# Altium project Production_v4.PrjPcb
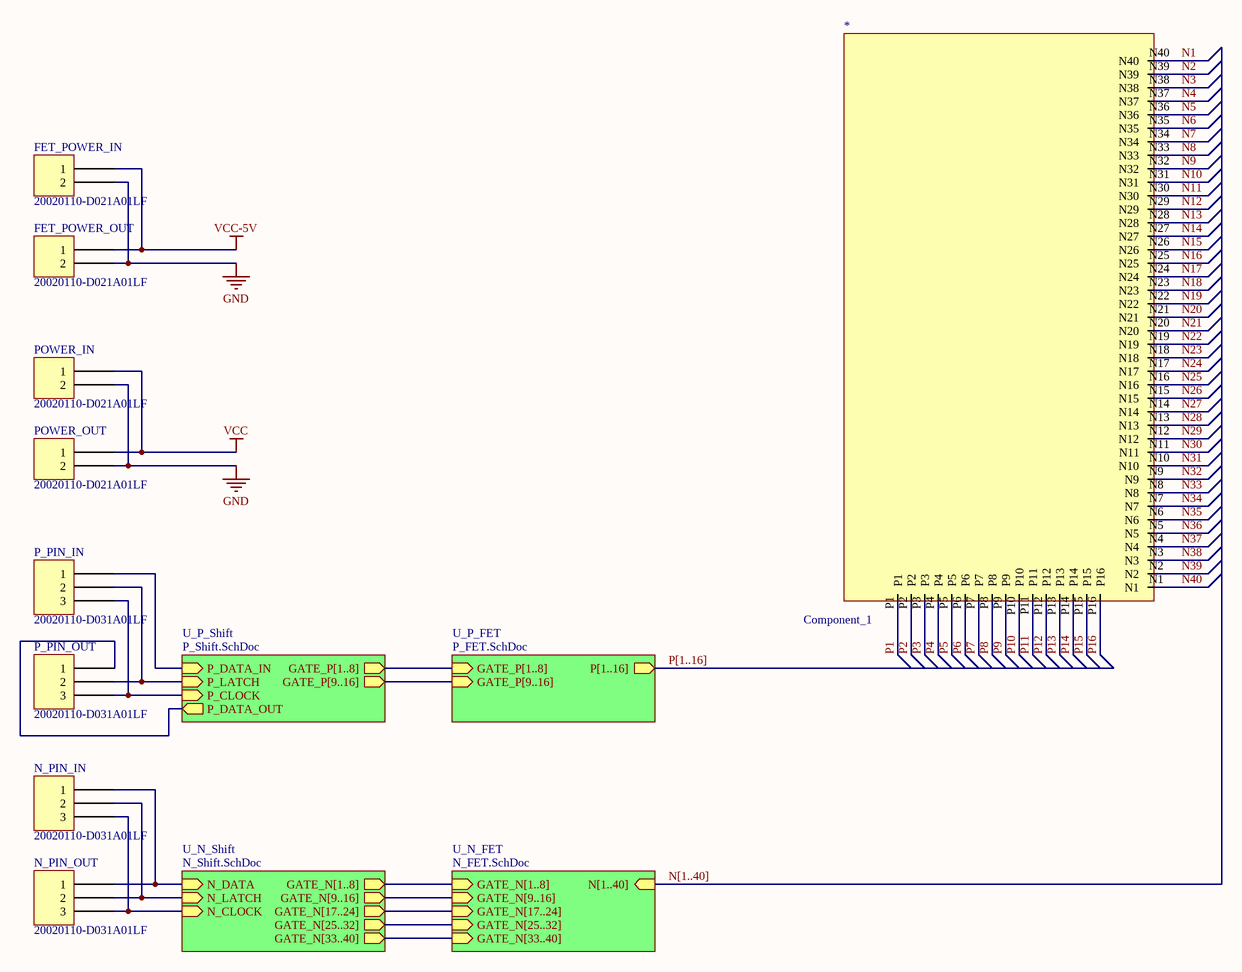
[diagram p0: Top_Layer.SchDoc]
5 sheets, 72 parts. Net scope: hierarchical (ports join the sheet entries above them; power ports are global).
Board file: Production_v4.PcbDoc
Sheets:
  Top_Layer.SchDoc
    U_N_FET = N_FET.SchDoc
    U_N_Shift = N_Shift.SchDoc
    U_P_FET = P_FET.SchDoc
    U_P_Shift = P_Shift.SchDoc

## Sheet Top_Layer.SchDoc
size E

### Parts
*  Component_1  [PCBComponent_1]
FET_POWER_IN  20020110-D021A01LF  [FCI 06-381-2PIN]
FET_POWER_OUT  20020110-D021A01LF  [FCI 06-381-2PIN]
N_PIN_IN  20020110-D031A01LF  [FCI 06-381-3PIN]
N_PIN_OUT  20020110-D031A01LF  [FCI 06-381-3PIN]
P_PIN_IN  20020110-D031A01LF  [FCI 06-381-3PIN]
P_PIN_OUT  20020110-D031A01LF  [FCI 06-381-3PIN]
POWER_IN  20020110-D021A01LF  [FCI 06-381-2PIN]
POWER_OUT  20020110-D021A01LF  [FCI 06-381-2PIN]

### Sub-sheets
U_N_FET = N_FET.SchDoc: GATE_N[1..8] (in), GATE_N[9..16] (in), GATE_N[17..24] (in), GATE_N[25..32] (in), N[1..40] (in), GATE_N[33..40] (in)
U_N_Shift = N_Shift.SchDoc: GATE_N[1..8] (out), GATE_N[9..16] (out), GATE_N[17..24] (out), GATE_N[25..32] (out), GATE_N[33..40] (out), N_DATA (in), N_LATCH (in), N_CLOCK (in)
U_P_FET = P_FET.SchDoc: P[1..16] (out), GATE_P[1..8] (in), GATE_P[9..16] (in)
U_P_Shift = P_Shift.SchDoc: P_LATCH (in), P_CLOCK (in), GATE_P[1..8] (out), GATE_P[9..16] (out), P_DATA_IN (in), P_DATA_OUT (out)

### Nets
GND: FET_POWER_IN.2 FET_POWER_OUT.2 POWER_IN.2 POWER_OUT.2
VCC: POWER_IN.1 POWER_OUT.1
VCC-5V: FET_POWER_IN.1 FET_POWER_OUT.1
N1: *.N40
N2: *.N39
N3: *.N38
N4: *.N37
N5: *.N36
N6: *.N35
N7: *.N34
N8: *.N33
N9: *.N32
N10: *.N31
N11: *.N30
N12: *.N29
N13: *.N28
N14: *.N27
N15: *.N26
N16: *.N25
N17: *.N24
N18: *.N23
N19: *.N22
N20: *.N21
N21: *.N20
N22: *.N19
N23: *.N18
N24: *.N17
N25: *.N16
N26: *.N15
N27: *.N14
N28: *.N13
N29: *.N12
N30: *.N11
N31: *.N10
N32: *.N9
N33: *.N8
N34: *.N7
N35: *.N6
N36: *.N5
N37: *.N4
N38: *.N3
N39: *.N2
N40: *.N1
P1: *.P1
P2: *.P2
P3: *.P3
P4: *.P4
P5: *.P5
P6: *.P6
P7: *.P7
P8: *.P8
P9: *.P9
P10: *.P10
P11: *.P11
P12: *.P12
P13: *.P13
P14: *.P14
P15: *.P15
P16: *.P16
NetN_PIN_IN_1: N_PIN_IN.1 N_PIN_OUT.1 ; sheet U_N_Shift/N_DATA
NetN_PIN_IN_2: N_PIN_IN.2 N_PIN_OUT.2 ; sheet U_N_Shift/N_LATCH
NetN_PIN_IN_3: N_PIN_IN.3 N_PIN_OUT.3 ; sheet U_N_Shift/N_CLOCK
NetP_PIN_IN_1: P_PIN_IN.1 ; sheet U_P_Shift/P_DATA_IN
NetP_PIN_IN_2: P_PIN_IN.2 P_PIN_OUT.2 ; sheet U_P_Shift/P_LATCH
NetP_PIN_IN_3: P_PIN_IN.3 P_PIN_OUT.3 ; sheet U_P_Shift/P_CLOCK
NetP_PIN_OUT_1: P_PIN_OUT.1 ; sheet U_P_Shift/P_DATA_OUT

### Buses and harness runs
bus N[1..40] = sheet U_N_FET/N[1..40]
bus P[1..16] = sheet U_P_FET/P[1..16]
bus sheet U_N_FET/GATE_N[1..8] = sheet U_N_Shift/GATE_N[1..8]
bus sheet U_N_FET/GATE_N[9..16] = sheet U_N_Shift/GATE_N[9..16]
bus sheet U_N_FET/GATE_N[17..24] = sheet U_N_Shift/GATE_N[17..24]
bus sheet U_N_FET/GATE_N[25..32] = sheet U_N_Shift/GATE_N[25..32]
bus sheet U_N_FET/GATE_N[33..40] = sheet U_N_Shift/GATE_N[33..40]
bus sheet U_P_FET/GATE_P[1..8] = sheet U_P_Shift/GATE_P[1..8]
bus sheet U_P_FET/GATE_P[9..16] = sheet U_P_Shift/GATE_P[9..16]

### Library data of the parts
FET_POWER_IN FET_POWER_OUT POWER_IN POWER_OUT = 20020110-D021A01LF: TERM BLOCK HDR 2POS R/A 3.81MM; Manufacturer: FCI; TemperatureRange: -40C ~ 115C; Voltage: 300V; Pitch: 0.150" (3.81mm); Number Of Positions: 2; Number Of Levels: 1; Part Number: 20020110-D021A01LF; PartId: 7785; Supplier 1: Digi-Key; Supplier Part Number 1: 609-3819-ND; ComponentLink1Description: Datasheet; ComponentLink1URL: http://portal.fciconnect.com/Comergent//fci/drawing/20020110.pdf; ComponentLink2Description: Digi-Key Listing; ComponentLink2URL: http://www.digikey.ca/product-detail/en/20020110-D021A01LF/609-3819-ND/2261255; Price: .75; Type: Through Hole; Colour: Green; Orientation: 90, Right Angle; Positions Per Level: 2
N_PIN_IN N_PIN_OUT P_PIN_IN P_PIN_OUT = 20020110-D031A01LF: TERM BLOCK HDR 3POS R/A 3.81MM; Manufacturer: FCI; TemperatureRange: -40C ~ 115C; Voltage: 300V; Pitch: 0.150" (3.81mm); Number Of Positions: 3; Number Of Levels: 1; Part Number: 20020110-D031A01LF; PartId: 7786; Supplier 1: Digi-Key; Supplier Part Number 1: 609-3820-ND; ComponentLink1Description: Datasheet; ComponentLink1URL: http://portal.fciconnect.com/Comergent//fci/drawing/20020110.pdf; ComponentLink2Description: Digi-Key Listing; ComponentLink2URL: http://www.digikey.ca/product-detail/en/20020110-D031A01LF/609-3820-ND/2261261; Price: 1.12; Type: Through Hole; Colour: Green; Orientation: 90, Right Angle; Positions Per Level: 3

## Sheet N_FET.SchDoc
size 1270 x 241 mm
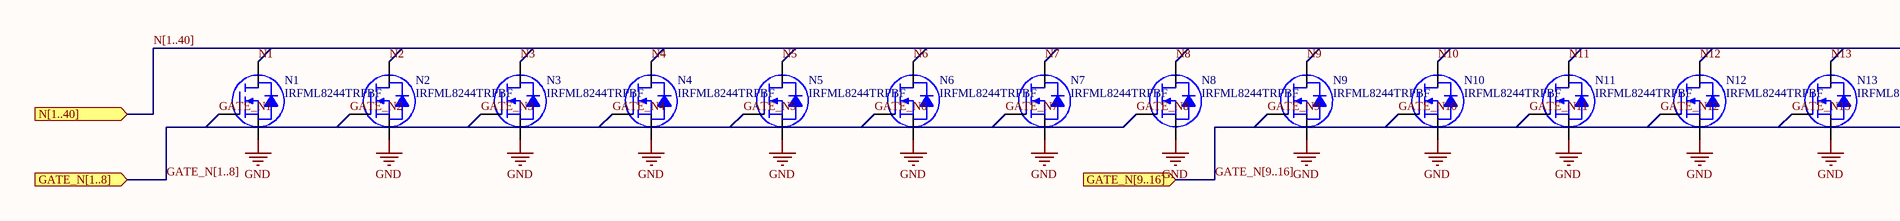
[diagram p1: N_FET.SchDoc, left]
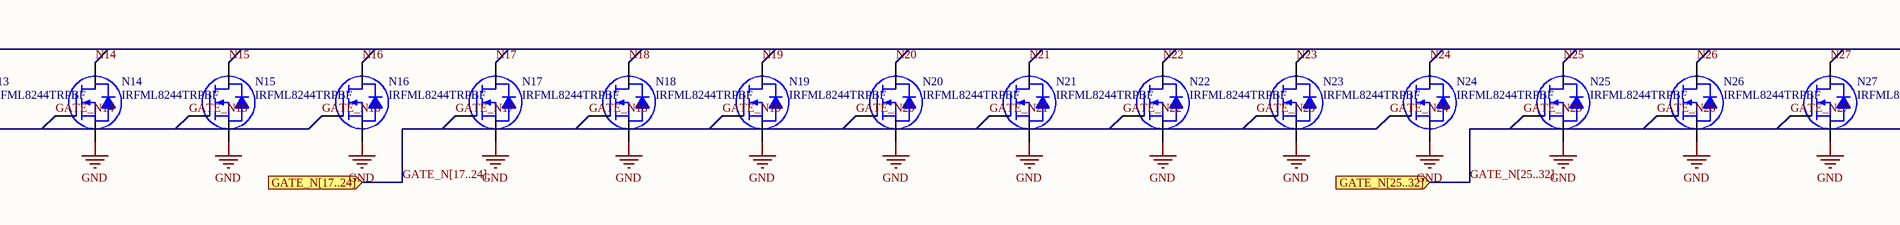
[diagram p2: N_FET.SchDoc, middle]
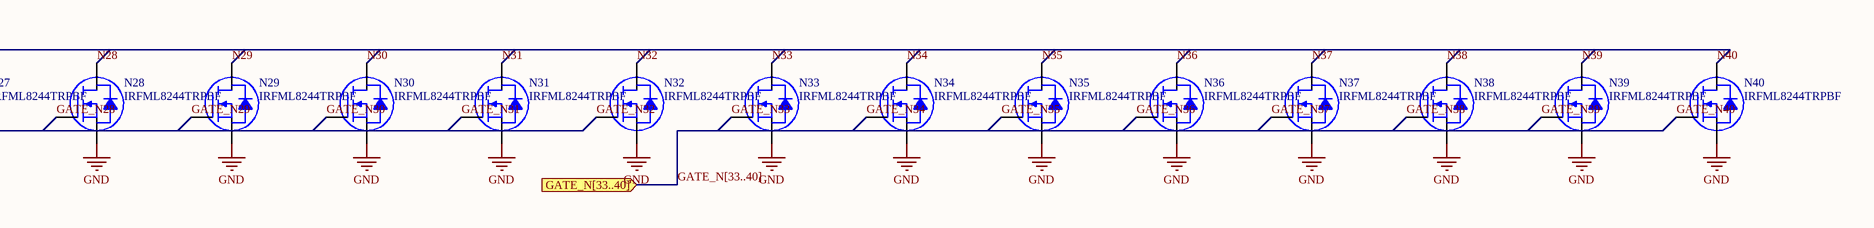
[diagram p3: N_FET.SchDoc, right]

### Parts
N1  IRFML8244TRPBF  [INFINEON SOT-23-3]
N2  IRFML8244TRPBF  [INFINEON SOT-23-3]
N3  IRFML8244TRPBF  [INFINEON SOT-23-3]
N4  IRFML8244TRPBF  [INFINEON SOT-23-3]
N5  IRFML8244TRPBF  [INFINEON SOT-23-3]
N6  IRFML8244TRPBF  [INFINEON SOT-23-3]
N7  IRFML8244TRPBF  [INFINEON SOT-23-3]
N8  IRFML8244TRPBF  [INFINEON SOT-23-3]
N9  IRFML8244TRPBF  [INFINEON SOT-23-3]
N10  IRFML8244TRPBF  [INFINEON SOT-23-3]
N11  IRFML8244TRPBF  [INFINEON SOT-23-3]
N12  IRFML8244TRPBF  [INFINEON SOT-23-3]
N13  IRFML8244TRPBF  [INFINEON SOT-23-3]
N14  IRFML8244TRPBF  [INFINEON SOT-23-3]
N15  IRFML8244TRPBF  [INFINEON SOT-23-3]
N16  IRFML8244TRPBF  [INFINEON SOT-23-3]
N17  IRFML8244TRPBF  [INFINEON SOT-23-3]
N18  IRFML8244TRPBF  [INFINEON SOT-23-3]
N19  IRFML8244TRPBF  [INFINEON SOT-23-3]
N20  IRFML8244TRPBF  [INFINEON SOT-23-3]
N21  IRFML8244TRPBF  [INFINEON SOT-23-3]
N22  IRFML8244TRPBF  [INFINEON SOT-23-3]
N23  IRFML8244TRPBF  [INFINEON SOT-23-3]
N24  IRFML8244TRPBF  [INFINEON SOT-23-3]
N25  IRFML8244TRPBF  [INFINEON SOT-23-3]
N26  IRFML8244TRPBF  [INFINEON SOT-23-3]
N27  IRFML8244TRPBF  [INFINEON SOT-23-3]
N28  IRFML8244TRPBF  [INFINEON SOT-23-3]
N29  IRFML8244TRPBF  [INFINEON SOT-23-3]
N30  IRFML8244TRPBF  [INFINEON SOT-23-3]
N31  IRFML8244TRPBF  [INFINEON SOT-23-3]
N32  IRFML8244TRPBF  [INFINEON SOT-23-3]
N33  IRFML8244TRPBF  [INFINEON SOT-23-3]
N34  IRFML8244TRPBF  [INFINEON SOT-23-3]
N35  IRFML8244TRPBF  [INFINEON SOT-23-3]
N36  IRFML8244TRPBF  [INFINEON SOT-23-3]
N37  IRFML8244TRPBF  [INFINEON SOT-23-3]
N38  IRFML8244TRPBF  [INFINEON SOT-23-3]
N39  IRFML8244TRPBF  [INFINEON SOT-23-3]
N40  IRFML8244TRPBF  [INFINEON SOT-23-3]

### Ports
GATE_N[1..8] (in), GATE_N[9..16] (in), GATE_N[17..24] (in), GATE_N[25..32] (in), GATE_N[33..40] (in), N[1..40] (in)

### Nets
GND: N1.3(S) N2.3(S) N3.3(S) N4.3(S) N5.3(S) N6.3(S) N7.3(S) N8.3(S) N9.3(S) N10.3(S) N11.3(S) N12.3(S) N13.3(S) N14.3(S) N15.3(S) N16.3(S) N17.3(S) N18.3(S) N19.3(S) N20.3(S) N21.3(S) N22.3(S) N23.3(S) N24.3(S) N25.3(S) N26.3(S) N27.3(S) N28.3(S) N29.3(S) N30.3(S) N31.3(S) N32.3(S) N33.3(S) N34.3(S) N35.3(S) N36.3(S) N37.3(S) N38.3(S) N39.3(S) N40.3(S)
GATE_N1: N1.1(G)
GATE_N2: N2.1(G)
GATE_N3: N3.1(G)
GATE_N4: N4.1(G)
GATE_N5: N5.1(G)
GATE_N6: N6.1(G)
GATE_N7: N7.1(G)
GATE_N8: N8.1(G)
GATE_N9: N9.1(G)
GATE_N10: N10.1(G)
GATE_N11: N11.1(G)
GATE_N12: N12.1(G)
GATE_N13: N13.1(G)
GATE_N14: N14.1(G)
GATE_N15: N15.1(G)
GATE_N16: N16.1(G)
GATE_N17: N17.1(G)
GATE_N18: N18.1(G)
GATE_N19: N19.1(G)
GATE_N20: N20.1(G)
GATE_N21: N21.1(G)
GATE_N22: N22.1(G)
GATE_N23: N23.1(G)
GATE_N24: N24.1(G)
GATE_N25: N25.1(G)
GATE_N26: N26.1(G)
GATE_N27: N27.1(G)
GATE_N28: N28.1(G)
GATE_N29: N29.1(G)
GATE_N30: N30.1(G)
GATE_N31: N31.1(G)
GATE_N32: N32.1(G)
GATE_N33: N33.1(G)
GATE_N34: N34.1(G)
GATE_N35: N35.1(G)
GATE_N36: N36.1(G)
GATE_N37: N37.1(G)
GATE_N38: N38.1(G)
GATE_N39: N39.1(G)
GATE_N40: N40.1(G)
N1: N1.2(D)
N2: N2.2(D)
N3: N3.2(D)
N4: N4.2(D)
N5: N5.2(D)
N6: N6.2(D)
N7: N7.2(D)
N8: N8.2(D)
N9: N9.2(D)
N10: N10.2(D)
N11: N11.2(D)
N12: N12.2(D)
N13: N13.2(D)
N14: N14.2(D)
N15: N15.2(D)
N16: N16.2(D)
N17: N17.2(D)
N18: N18.2(D)
N19: N19.2(D)
N20: N20.2(D)
N21: N21.2(D)
N22: N22.2(D)
N23: N23.2(D)
N24: N24.2(D)
N25: N25.2(D)
N26: N26.2(D)
N27: N27.2(D)
N28: N28.2(D)
N29: N29.2(D)
N30: N30.2(D)
N31: N31.2(D)
N32: N32.2(D)
N33: N33.2(D)
N34: N34.2(D)
N35: N35.2(D)
N36: N36.2(D)
N37: N37.2(D)
N38: N38.2(D)
N39: N39.2(D)
N40: N40.2(D)

### Buses and harness runs
bus GATE_N[1..8] = port GATE_N[1..8]
bus GATE_N[9..16] = port GATE_N[9..16]
bus GATE_N[17..24] = port GATE_N[17..24]
bus GATE_N[25..32] = port GATE_N[25..32]
bus GATE_N[33..40] = port GATE_N[33..40]
bus N[1..40] = port N[1..40]

### Library data of the parts
N1-N40 = IRFML8244TRPBF: MOSFET N-CH 25V 5.8A SOT23; Manufacturer: Infineon Technologies; Rds On (Max) at Id, Vgs: 24 mOhm @ 5.8A, 10V; Vgs(th) (Max) at Id: 20V; Gate Charge (Qg): 5.4nC @ 10V; Input Capacitance (Ciss) at Vds: 430pF @ 10V; Current Continuous Drain: 5.8A (Ta); Part Number: IRFML8244TRPBF; PartId: 29462; Supplier 1: Digi-Key; Supplier Part Number 1: IRFML8244TRPBFCT-ND; ComponentLink1Description: Datasheet; ComponentLink1URL: http://www.irf.com/product-info/datasheets/data/irfml8244pbf.pdf; ComponentLink2Description: Digi-Key Listing; ComponentLink2URL: https://www.digikey.com/product-detail/en/infineon-technologies/IRFML8244TRPBF/IRFML8244TRPBFCT-ND/2538166; Price: .67; Type: N-Channel; Device Package: TO-236-3, SC-59, SOT-23-3; Drain to Source Voltage (Vdss): 25V

## Sheet N_Shift.SchDoc
size E
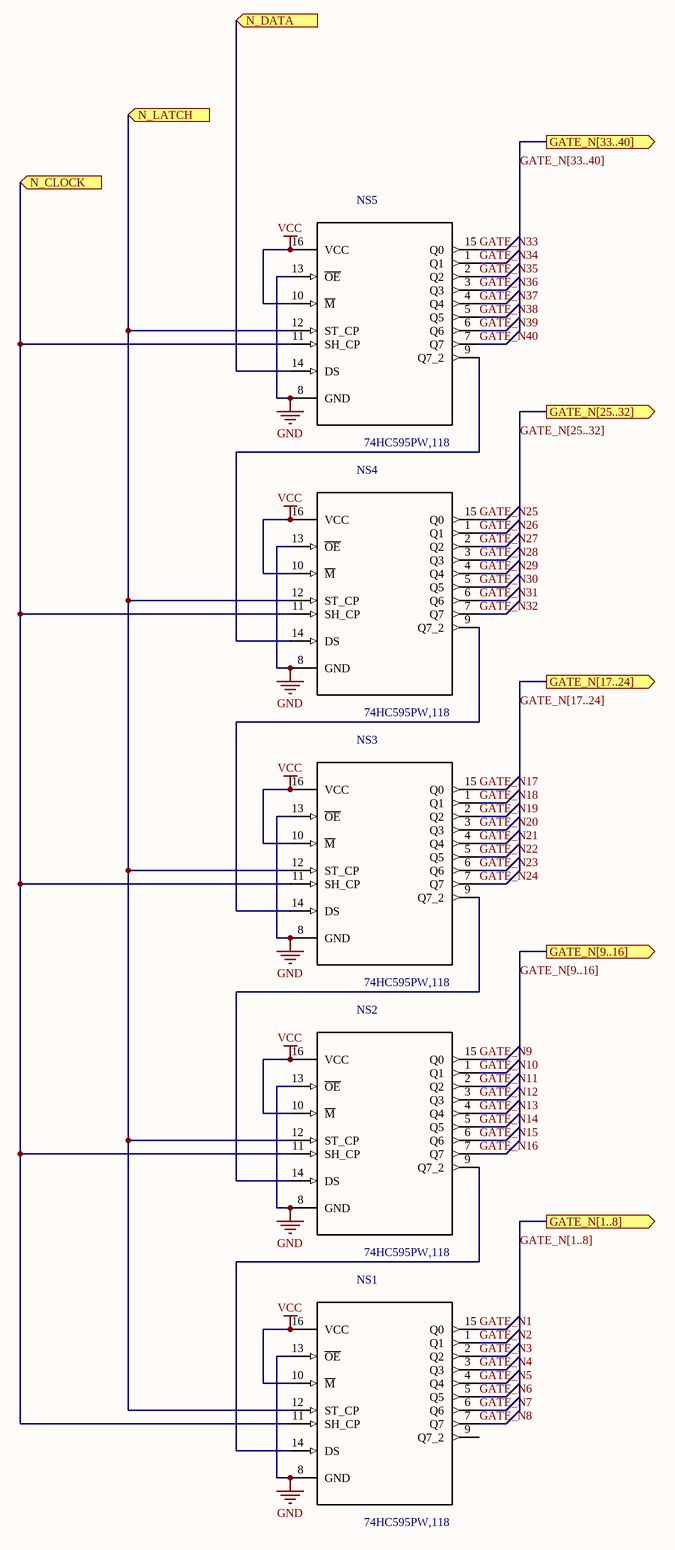
[diagram p4: N_Shift.SchDoc]

### Parts
NS1  74HC595PW,118  [SOP65P640X110-16N]
NS2  74HC595PW,118  [SOP65P640X110-16N]
NS3  74HC595PW,118  [SOP65P640X110-16N]
NS4  74HC595PW,118  [SOP65P640X110-16N]
NS5  74HC595PW,118  [SOP65P640X110-16N]

### Ports
GATE_N[1..8] (out), GATE_N[9..16] (out), GATE_N[17..24] (out), GATE_N[25..32] (out), GATE_N[33..40] (out), N_CLOCK (in), N_DATA (in), N_LATCH (in)

### Nets
GND: NS1.8(GND) NS1.13(~{OE}) NS2.8(GND) NS2.13(~{OE}) NS3.8(GND) NS3.13(~{OE}) NS4.8(GND) NS4.13(~{OE}) NS5.8(GND) NS5.13(~{OE})
VCC: NS1.10(M~{}) NS1.16(VCC) NS2.10(M~{}) NS2.16(VCC) NS3.10(M~{}) NS3.16(VCC) NS4.10(M~{}) NS4.16(VCC) NS5.10(M~{}) NS5.16(VCC)
GATE_N1: NS1.15(Q0)
GATE_N2: NS1.1(Q1)
GATE_N3: NS1.2(Q2)
GATE_N4: NS1.3(Q3)
GATE_N5: NS1.4(Q4)
GATE_N6: NS1.5(Q5)
GATE_N7: NS1.6(Q6)
GATE_N8: NS1.7(Q7)
GATE_N9: NS2.15(Q0)
GATE_N10: NS2.1(Q1)
GATE_N11: NS2.2(Q2)
GATE_N12: NS2.3(Q3)
GATE_N13: NS2.4(Q4)
GATE_N14: NS2.5(Q5)
GATE_N15: NS2.6(Q6)
GATE_N16: NS2.7(Q7)
GATE_N17: NS3.15(Q0)
GATE_N18: NS3.1(Q1)
GATE_N19: NS3.2(Q2)
GATE_N20: NS3.3(Q3)
GATE_N21: NS3.4(Q4)
GATE_N22: NS3.5(Q5)
GATE_N23: NS3.6(Q6)
GATE_N24: NS3.7(Q7)
GATE_N25: NS4.15(Q0)
GATE_N26: NS4.1(Q1)
GATE_N27: NS4.2(Q2)
GATE_N28: NS4.3(Q3)
GATE_N29: NS4.4(Q4)
GATE_N30: NS4.5(Q5)
GATE_N31: NS4.6(Q6)
GATE_N32: NS4.7(Q7)
GATE_N33: NS5.15(Q0)
GATE_N34: NS5.1(Q1)
GATE_N35: NS5.2(Q2)
GATE_N36: NS5.3(Q3)
GATE_N37: NS5.4(Q4)
GATE_N38: NS5.5(Q5)
GATE_N39: NS5.6(Q6)
GATE_N40: NS5.7(Q7)
NetN_PIN_IN_1: NS5.14(DS) ; port N_DATA
NetN_PIN_IN_2: NS1.12(ST_CP) NS2.12(ST_CP) NS3.12(ST_CP) NS4.12(ST_CP) NS5.12(ST_CP) ; port N_LATCH
NetN_PIN_IN_3: NS1.11(SH_CP) NS2.11(SH_CP) NS3.11(SH_CP) NS4.11(SH_CP) NS5.11(SH_CP) ; port N_CLOCK
NetNS1_14: NS1.14(DS) NS2.9(Q7_2)
NetNS2_14: NS2.14(DS) NS3.9(Q7_2)
NetNS3_14: NS3.14(DS) NS4.9(Q7_2)
NetNS4_14: NS4.14(DS) NS5.9(Q7_2)

Not connected (* = marked no-connect by the designer): NS1 9(Q7_2)

### Buses and harness runs
bus GATE_N[1..8] = port GATE_N[1..8]
bus GATE_N[9..16] = port GATE_N[9..16]
bus GATE_N[17..24] = port GATE_N[17..24]
bus GATE_N[25..32] = port GATE_N[25..32]
bus GATE_N[33..40] = port GATE_N[33..40]

### Library data of the parts
NS1-NS5 = 74HC595PW,118: 8-bit serial-in%2C serial or parallel-out shift register with output latches%3B 3-state; MF: NXP Semiconductors; MP: 74HC595PW,118; Price: 0.17 USD; Availability: Good; Package: TSSOP-16 NXP Semiconductors; Value: *

## Sheet P_FET.SchDoc
size E
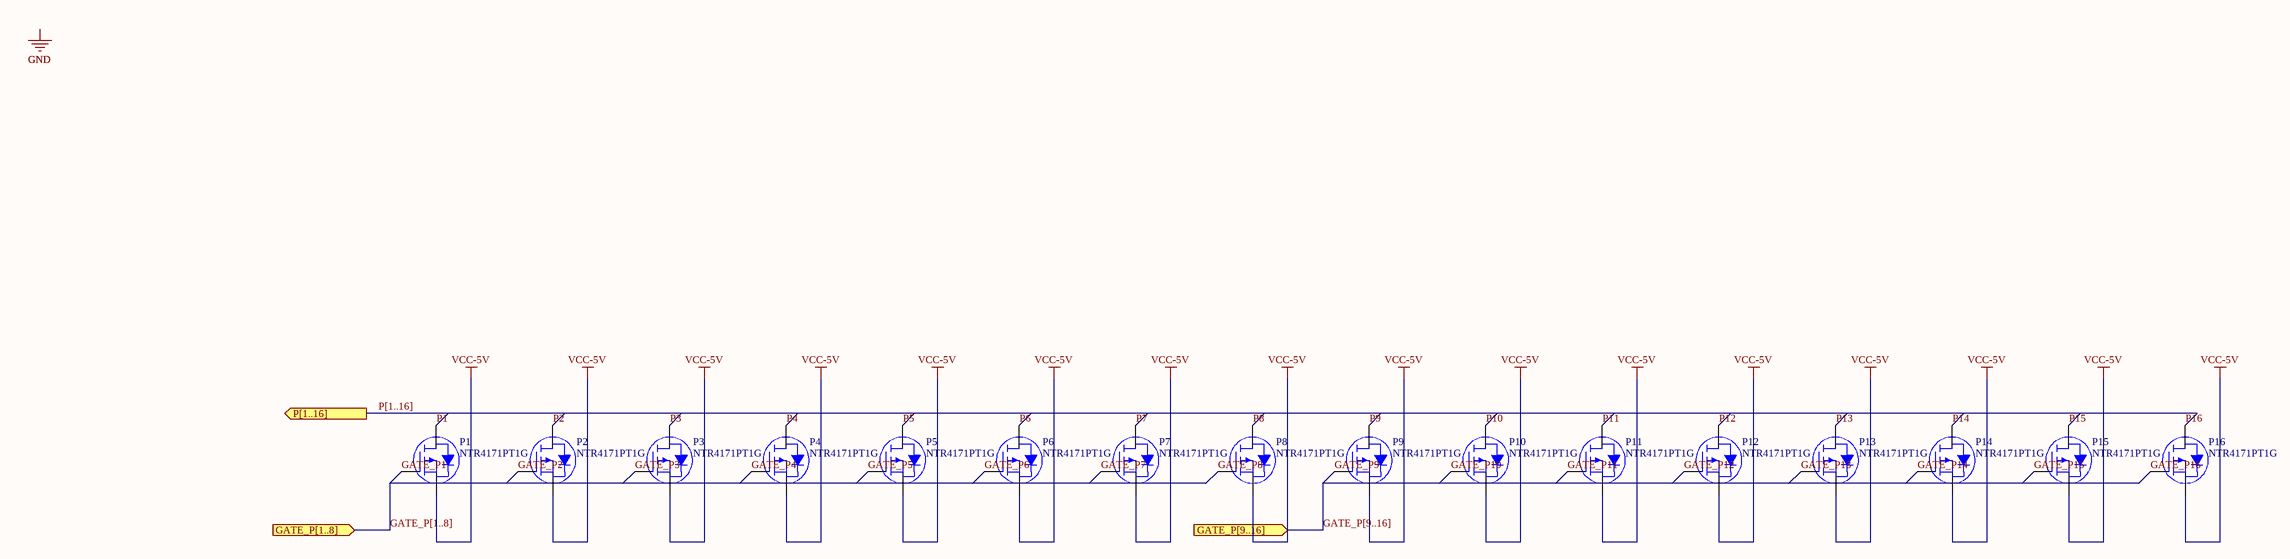
[diagram p5: P_FET.SchDoc]

### Parts
P1  NTR4171PT1G  [ON SEMI SOT-23-3]
P2  NTR4171PT1G  [ON SEMI SOT-23-3]
P3  NTR4171PT1G  [ON SEMI SOT-23-3]
P4  NTR4171PT1G  [ON SEMI SOT-23-3]
P5  NTR4171PT1G  [ON SEMI SOT-23-3]
P6  NTR4171PT1G  [ON SEMI SOT-23-3]
P7  NTR4171PT1G  [ON SEMI SOT-23-3]
P8  NTR4171PT1G  [ON SEMI SOT-23-3]
P9  NTR4171PT1G  [ON SEMI SOT-23-3]
P10  NTR4171PT1G  [ON SEMI SOT-23-3]
P11  NTR4171PT1G  [ON SEMI SOT-23-3]
P12  NTR4171PT1G  [ON SEMI SOT-23-3]
P13  NTR4171PT1G  [ON SEMI SOT-23-3]
P14  NTR4171PT1G  [ON SEMI SOT-23-3]
P15  NTR4171PT1G  [ON SEMI SOT-23-3]
P16  NTR4171PT1G  [ON SEMI SOT-23-3]

### Ports
GATE_P[1..8] (in), GATE_P[9..16] (in), P[1..16] (out)

### Nets
VCC-5V: P1.3(S) P2.3(S) P3.3(S) P4.3(S) P5.3(S) P6.3(S) P7.3(S) P8.3(S) P9.3(S) P10.3(S) P11.3(S) P12.3(S) P13.3(S) P14.3(S) P15.3(S) P16.3(S) ; port GATE_P[9..16]
GATE_P1: P1.1(G)
GATE_P2: P2.1(G)
GATE_P3: P3.1(G)
GATE_P4: P4.1(G)
GATE_P5: P5.1(G)
GATE_P6: P6.1(G)
GATE_P7: P7.1(G)
GATE_P8: P8.1(G)
GATE_P9: P9.1(G)
GATE_P10: P10.1(G)
GATE_P11: P11.1(G)
GATE_P12: P12.1(G)
GATE_P13: P13.1(G)
GATE_P14: P14.1(G)
GATE_P15: P15.1(G)
GATE_P16: P16.1(G)
P1: P1.2(D)
P2: P2.2(D)
P3: P3.2(D)
P4: P4.2(D)
P5: P5.2(D)
P6: P6.2(D)
P7: P7.2(D)
P8: P8.2(D)
P9: P9.2(D)
P10: P10.2(D)
P11: P11.2(D)
P12: P12.2(D)
P13: P13.2(D)
P14: P14.2(D)
P15: P15.2(D)
P16: P16.2(D)

### Buses and harness runs
bus GATE_P[1..8] = port GATE_P[1..8]
bus GATE_P[9..16]
bus P[1..16] = port P[1..16]

### Library data of the parts
P1-P16 = NTR4171PT1G: MOSFET P-CH 30V 2.2A SOT23; Manufacturer: ON Semiconductor; Rds On (Max) at Id, Vgs: 75 mOhm @ 2.2A, 10V; Vgs(th) (Max) at Id: 1.4V @ 250uA; Gate Charge (Qg): 15.6nC @ 10V; Input Capacitance (Ciss) at Vds: 720pF @ 15V; Power - Max: 480mW; Current Continuous Drain: 2.2A (Ta); Part Number: NTR4171PT1G; PartId: 8195; Supplier 1: Digi-Key; Supplier Part Number 1: NTR4171PT1GOSTR-ND; ComponentLink1Description: Datasheet; ComponentLink1URL: http://www.onsemi.com/pub_link/Collateral/NTR4171P-D.PDF; ComponentLink2Description: Digi-Key Listing; ComponentLink2URL: http://www.digikey.com/product-detail/en/NTR4171PT1G/NTR4171PT1GOSTR-ND/2050558; Price: .1024; Type: MOSFET P-Channel, Metal Oxide; Device Package: TO-236-3, SC-59, SOT-23-3; Drain to Source Voltage (Vdss): 30V; Features: Standard

## Sheet P_Shift.SchDoc
size E
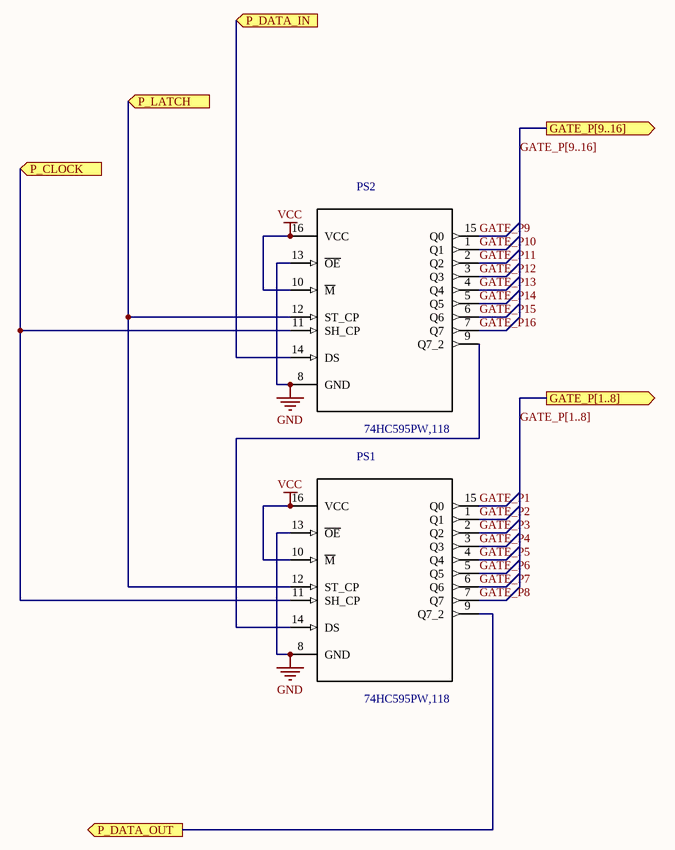
[diagram p6: P_Shift.SchDoc]

### Parts
PS1  74HC595PW,118  [SOP65P640X110-16N]
PS2  74HC595PW,118  [SOP65P640X110-16N]

### Ports
GATE_P[1..8] (out), GATE_P[9..16] (out), P_CLOCK (in), P_DATA_IN (in), P_DATA_OUT (out), P_LATCH (in)

### Nets
GND: PS1.8(GND) PS1.13(~{OE}) PS2.8(GND) PS2.13(~{OE})
VCC: PS1.10(M~{}) PS1.16(VCC) PS2.10(M~{}) PS2.16(VCC)
GATE_P1: PS1.15(Q0)
GATE_P2: PS1.1(Q1)
GATE_P3: PS1.2(Q2)
GATE_P4: PS1.3(Q3)
GATE_P5: PS1.4(Q4)
GATE_P6: PS1.5(Q5)
GATE_P7: PS1.6(Q6)
GATE_P8: PS1.7(Q7)
GATE_P9: PS2.15(Q0)
GATE_P10: PS2.1(Q1)
GATE_P11: PS2.2(Q2)
GATE_P12: PS2.3(Q3)
GATE_P13: PS2.4(Q4)
GATE_P14: PS2.5(Q5)
GATE_P15: PS2.6(Q6)
GATE_P16: PS2.7(Q7)
NetP_PIN_IN_1: PS2.14(DS) ; port P_DATA_IN
NetP_PIN_IN_2: PS1.12(ST_CP) PS2.12(ST_CP) ; port P_LATCH
NetP_PIN_IN_3: PS1.11(SH_CP) PS2.11(SH_CP) ; port P_CLOCK
NetP_PIN_OUT_1: PS1.9(Q7_2) ; port P_DATA_OUT
NetPS1_14: PS1.14(DS) PS2.9(Q7_2)

### Buses and harness runs
bus GATE_P[1..8] = port GATE_P[1..8]
bus GATE_P[9..16] = port GATE_P[9..16]

### Library data of the parts
PS1 PS2 = 74HC595PW,118: as NS1 on sheet N_Shift; MP: 74HC595PW,118; Price: 0.17 USD; Availability: Good; Package: TSSOP-16 NXP Semiconductors; Value: *

## Nets that join several sheets
GND: Top_Layer (FET_POWER_IN.2 FET_POWER_OUT.2 POWER_IN.2 POWER_OUT.2), N_FET (40 pins), N_Shift (10 pins), P_Shift (PS1.8 PS1.13 PS2.8 PS2.13)
VCC: Top_Layer (POWER_IN.1 POWER_OUT.1), N_Shift (10 pins), P_Shift (PS1.10 PS1.16 PS2.10 PS2.16)
VCC-5V: Top_Layer (FET_POWER_IN.1 FET_POWER_OUT.1), P_FET (16 pins)
GATE_N1: N_FET (N1.1), N_Shift (NS1.15)
GATE_N2: N_FET (N2.1), N_Shift (NS1.1)
GATE_N3: N_FET (N3.1), N_Shift (NS1.2)
GATE_N4: N_FET (N4.1), N_Shift (NS1.3)
GATE_N5: N_FET (N5.1), N_Shift (NS1.4)
GATE_N6: N_FET (N6.1), N_Shift (NS1.5)
GATE_N7: N_FET (N7.1), N_Shift (NS1.6)
GATE_N8: N_FET (N8.1), N_Shift (NS1.7)
GATE_N9: N_FET (N9.1), N_Shift (NS2.15)
GATE_N10: N_FET (N10.1), N_Shift (NS2.1)
GATE_N11: N_FET (N11.1), N_Shift (NS2.2)
GATE_N12: N_FET (N12.1), N_Shift (NS2.3)
GATE_N13: N_FET (N13.1), N_Shift (NS2.4)
GATE_N14: N_FET (N14.1), N_Shift (NS2.5)
GATE_N15: N_FET (N15.1), N_Shift (NS2.6)
GATE_N16: N_FET (N16.1), N_Shift (NS2.7)
GATE_N17: N_FET (N17.1), N_Shift (NS3.15)
GATE_N18: N_FET (N18.1), N_Shift (NS3.1)
GATE_N19: N_FET (N19.1), N_Shift (NS3.2)
GATE_N20: N_FET (N20.1), N_Shift (NS3.3)
GATE_N21: N_FET (N21.1), N_Shift (NS3.4)
GATE_N22: N_FET (N22.1), N_Shift (NS3.5)
GATE_N23: N_FET (N23.1), N_Shift (NS3.6)
GATE_N24: N_FET (N24.1), N_Shift (NS3.7)
GATE_N25: N_FET (N25.1), N_Shift (NS4.15)
GATE_N26: N_FET (N26.1), N_Shift (NS4.1)
GATE_N27: N_FET (N27.1), N_Shift (NS4.2)
GATE_N28: N_FET (N28.1), N_Shift (NS4.3)
GATE_N29: N_FET (N29.1), N_Shift (NS4.4)
GATE_N30: N_FET (N30.1), N_Shift (NS4.5)
GATE_N31: N_FET (N31.1), N_Shift (NS4.6)
GATE_N32: N_FET (N32.1), N_Shift (NS4.7)
GATE_N33: N_FET (N33.1), N_Shift (NS5.15)
GATE_N34: N_FET (N34.1), N_Shift (NS5.1)
GATE_N35: N_FET (N35.1), N_Shift (NS5.2)
GATE_N36: N_FET (N36.1), N_Shift (NS5.3)
GATE_N37: N_FET (N37.1), N_Shift (NS5.4)
GATE_N38: N_FET (N38.1), N_Shift (NS5.5)
GATE_N39: N_FET (N39.1), N_Shift (NS5.6)
GATE_N40: N_FET (N40.1), N_Shift (NS5.7)
GATE_P1: P_FET (P1.1), P_Shift (PS1.15)
GATE_P2: P_FET (P2.1), P_Shift (PS1.1)
GATE_P3: P_FET (P3.1), P_Shift (PS1.2)
GATE_P4: P_FET (P4.1), P_Shift (PS1.3)
GATE_P5: P_FET (P5.1), P_Shift (PS1.4)
GATE_P6: P_FET (P6.1), P_Shift (PS1.5)
GATE_P7: P_FET (P7.1), P_Shift (PS1.6)
GATE_P8: P_FET (P8.1), P_Shift (PS1.7)
N1: Top_Layer (*.N40), N_FET (N1.2)
N2: Top_Layer (*.N39), N_FET (N2.2)
N3: Top_Layer (*.N38), N_FET (N3.2)
N4: Top_Layer (*.N37), N_FET (N4.2)
N5: Top_Layer (*.N36), N_FET (N5.2)
N6: Top_Layer (*.N35), N_FET (N6.2)
N7: Top_Layer (*.N34), N_FET (N7.2)
N8: Top_Layer (*.N33), N_FET (N8.2)
N9: Top_Layer (*.N32), N_FET (N9.2)
N10: Top_Layer (*.N31), N_FET (N10.2)
N11: Top_Layer (*.N30), N_FET (N11.2)
N12: Top_Layer (*.N29), N_FET (N12.2)
N13: Top_Layer (*.N28), N_FET (N13.2)
N14: Top_Layer (*.N27), N_FET (N14.2)
N15: Top_Layer (*.N26), N_FET (N15.2)
N16: Top_Layer (*.N25), N_FET (N16.2)
N17: Top_Layer (*.N24), N_FET (N17.2)
N18: Top_Layer (*.N23), N_FET (N18.2)
N19: Top_Layer (*.N22), N_FET (N19.2)
N20: Top_Layer (*.N21), N_FET (N20.2)
N21: Top_Layer (*.N20), N_FET (N21.2)
N22: Top_Layer (*.N19), N_FET (N22.2)
N23: Top_Layer (*.N18), N_FET (N23.2)
N24: Top_Layer (*.N17), N_FET (N24.2)
N25: Top_Layer (*.N16), N_FET (N25.2)
N26: Top_Layer (*.N15), N_FET (N26.2)
N27: Top_Layer (*.N14), N_FET (N27.2)
N28: Top_Layer (*.N13), N_FET (N28.2)
N29: Top_Layer (*.N12), N_FET (N29.2)
N30: Top_Layer (*.N11), N_FET (N30.2)
N31: Top_Layer (*.N10), N_FET (N31.2)
N32: Top_Layer (*.N9), N_FET (N32.2)
N33: Top_Layer (*.N8), N_FET (N33.2)
N34: Top_Layer (*.N7), N_FET (N34.2)
N35: Top_Layer (*.N6), N_FET (N35.2)
N36: Top_Layer (*.N5), N_FET (N36.2)
N37: Top_Layer (*.N4), N_FET (N37.2)
N38: Top_Layer (*.N3), N_FET (N38.2)
N39: Top_Layer (*.N2), N_FET (N39.2)
N40: Top_Layer (*.N1), N_FET (N40.2)
NetN_PIN_IN_1: Top_Layer (N_PIN_IN.1 N_PIN_OUT.1), N_Shift (NS5.14)
NetN_PIN_IN_2: Top_Layer (N_PIN_IN.2 N_PIN_OUT.2), N_Shift (5 pins)
NetN_PIN_IN_3: Top_Layer (N_PIN_IN.3 N_PIN_OUT.3), N_Shift (5 pins)
NetP_PIN_IN_1: Top_Layer (P_PIN_IN.1), P_Shift (PS2.14)
NetP_PIN_IN_2: Top_Layer (P_PIN_IN.2 P_PIN_OUT.2), P_Shift (PS1.12 PS2.12)
NetP_PIN_IN_3: Top_Layer (P_PIN_IN.3 P_PIN_OUT.3), P_Shift (PS1.11 PS2.11)
NetP_PIN_OUT_1: Top_Layer (P_PIN_OUT.1), P_Shift (PS1.9)
P1: Top_Layer (*.P1), P_FET (P1.2)
P2: Top_Layer (*.P2), P_FET (P2.2)
P3: Top_Layer (*.P3), P_FET (P3.2)
P4: Top_Layer (*.P4), P_FET (P4.2)
P5: Top_Layer (*.P5), P_FET (P5.2)
P6: Top_Layer (*.P6), P_FET (P6.2)
P7: Top_Layer (*.P7), P_FET (P7.2)
P8: Top_Layer (*.P8), P_FET (P8.2)
P9: Top_Layer (*.P9), P_FET (P9.2)
P10: Top_Layer (*.P10), P_FET (P10.2)
P11: Top_Layer (*.P11), P_FET (P11.2)
P12: Top_Layer (*.P12), P_FET (P12.2)
P13: Top_Layer (*.P13), P_FET (P13.2)
P14: Top_Layer (*.P14), P_FET (P14.2)
P15: Top_Layer (*.P15), P_FET (P15.2)
P16: Top_Layer (*.P16), P_FET (P16.2)